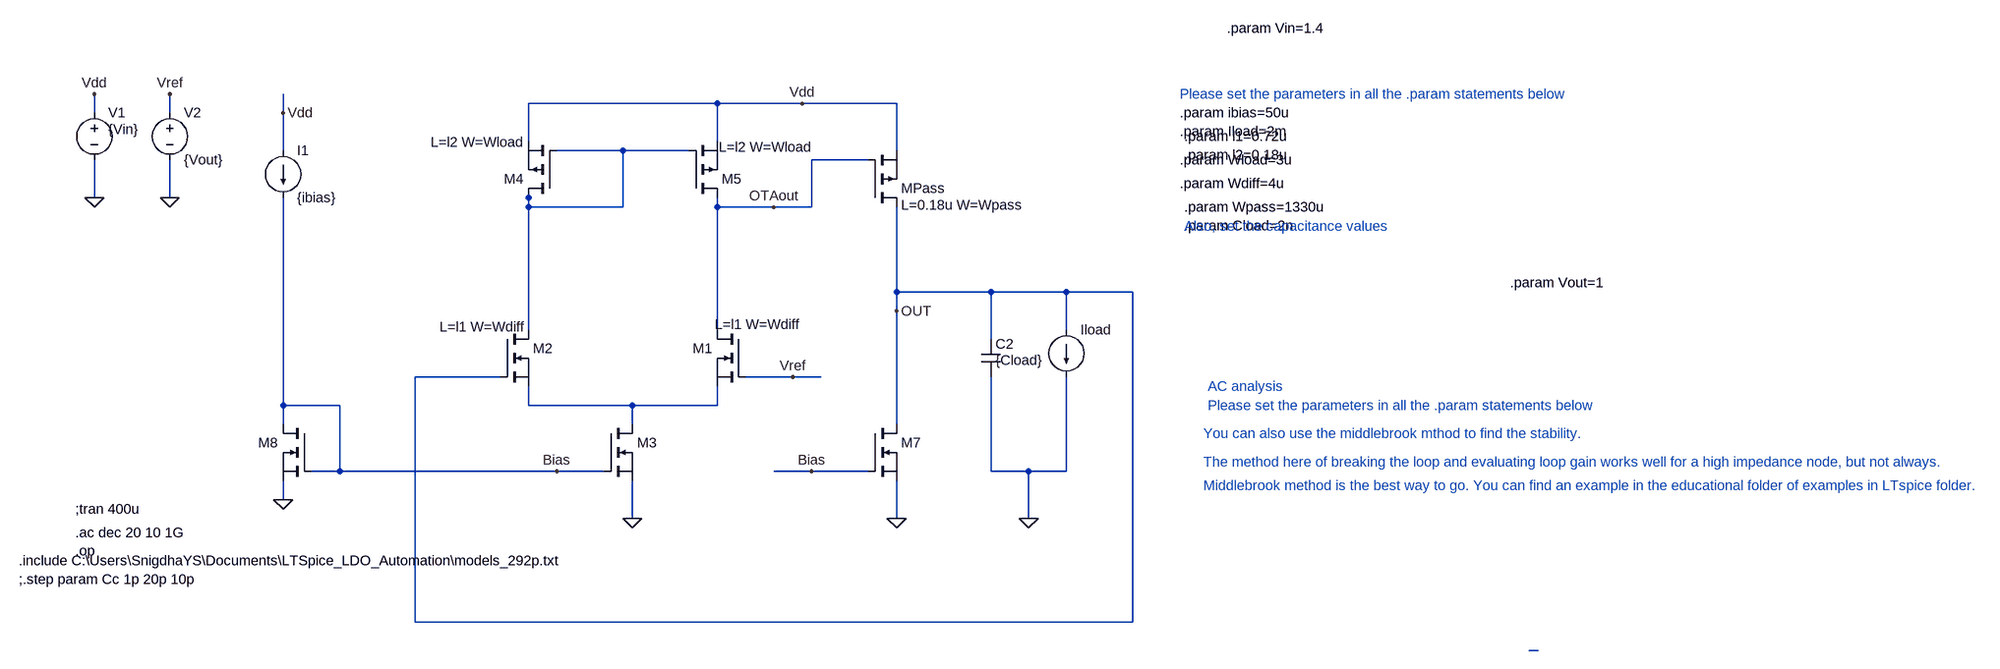
[diagram p0: schematic LDO_PSRR_IIIT_updated.asc]
LDO_PSRR_IIIT_updated.asc, the LTspice schematic file:
Version 4
.param ibias=10.0 Iload=10.0 Wdiff=0.7723647085355052 Wpass=1.1331343651728623 Cload=1.0 Wload=2.28647097820951 Vin=1.4 Vout=1.0 l1=0.72 l2=0.54
SHEET 1 5048 1020
WIRE 288 -288 -32 -288
WIRE 432 -288 288 -288
WIRE 592 -288 432 -288
WIRE -768 -272 -768 -304
WIRE -640 -272 -640 -304
WIRE -448 -272 -448 -304
WIRE -32 -224 -32 -288
WIRE 288 -224 288 -288
WIRE -448 -208 -448 -272
WIRE 128 -208 16 -208
WIRE 240 -208 128 -208
WIRE 592 -208 592 -288
WIRE 544 -192 448 -192
WIRE -768 -128 -768 -192
WIRE -640 -128 -640 -192
WIRE -32 -128 -32 -144
WIRE -32 -112 -32 -128
WIRE 128 -112 128 -208
WIRE 128 -112 -32 -112
WIRE 288 -112 288 -128
WIRE 384 -112 288 -112
WIRE 448 -112 448 -192
WIRE 448 -112 384 -112
WIRE 592 32 592 -112
WIRE 752 32 592 32
WIRE 880 32 752 32
WIRE 992 32 880 32
WIRE 592 64 592 32
WIRE -32 96 -32 -112
WIRE 288 96 288 -112
WIRE 880 96 880 32
WIRE 752 112 752 32
WIRE -80 176 -224 176
WIRE 416 176 336 176
WIRE 464 176 416 176
WIRE -448 224 -448 -128
WIRE -352 224 -448 224
WIRE -32 224 -32 192
WIRE 144 224 -32 224
WIRE 288 224 288 192
WIRE 288 224 144 224
WIRE -448 256 -448 224
WIRE 144 256 144 224
WIRE 592 256 592 64
WIRE -352 336 -352 224
WIRE -352 336 -400 336
WIRE 16 336 -352 336
WIRE 96 336 16 336
WIRE 448 336 384 336
WIRE 544 336 448 336
WIRE 752 336 752 176
WIRE 816 336 752 336
WIRE 880 336 880 176
WIRE 880 336 816 336
WIRE -448 384 -448 352
WIRE 144 416 144 352
WIRE 592 416 592 352
WIRE 816 416 816 336
WIRE -224 592 -224 176
WIRE 992 592 992 32
WIRE 992 592 -224 592
WIRE 1680 640 1664 640
FLAG 144 416 0
FLAG 592 416 0
FLAG 448 336 Bias
FLAG 16 336 Bias
FLAG 592 64 OUT
FLAG -768 -128 0
FLAG -768 -304 Vdd
FLAG 432 -288 Vdd
FLAG -640 -128 0
FLAG -640 -304 Vref
FLAG 416 176 Vref
FLAG -448 384 0
FLAG -448 -272 Vdd
FLAG 816 416 0
FLAG 384 -112 OTAout
DATAFLAG 672 32 "$"
DATAFLAG -80 336 "$"
DATAFLAG 16 224 "$"
DATAFLAG 80 -112 "$"
DATAFLAG 160 -288 "$"
DATAFLAG 288 -16 "$"
SYMBOL nmos 336 96 M0
WINDOW 3 56 72 Invisible 2
WINDOW 39 -93 -9 Left 2
SYMATTR Value nmos292p
SYMATTR SpiceLine L=l1 W=Wdiff
SYMATTR InstName M1
SYMBOL nmos -80 96 R0
WINDOW 3 56 72 Invisible 2
WINDOW 39 -103 -5 Left 2
SYMATTR Value nmos292p
SYMATTR SpiceLine L=l1 W=Wdiff
SYMATTR InstName M2
SYMBOL nmos 96 256 R0
WINDOW 3 56 72 Invisible 2
SYMATTR Value nmos292p
SYMATTR InstName M3
SYMATTR SpiceLine L=1u W=10u
SYMBOL pmos 16 -128 R180
WINDOW 3 56 72 Invisible 2
WINDOW 39 55 94 Left 2
SYMATTR Value pmos292p
SYMATTR SpiceLine L=l2 W=Wload
SYMATTR InstName M4
SYMBOL pmos 240 -128 M180
WINDOW 3 56 72 Invisible 2
WINDOW 39 51 86 Left 2
SYMATTR Value pmos292p
SYMATTR SpiceLine L=l2 W=Wload
SYMATTR InstName M5
SYMBOL pmos 544 -112 M180
WINDOW 3 56 72 Invisible 2
WINDOW 39 56 4 Left 2
SYMATTR Value pmos292p
SYMATTR SpiceLine L=0.18u W=Wpass
SYMATTR InstName MPass
SYMBOL nmos 544 256 R0
WINDOW 3 56 72 Invisible 2
SYMATTR Value nmos292p
SYMATTR InstName M7
SYMATTR SpiceLine L=1u W=10u
SYMBOL voltage -768 -288 R0
WINDOW 3 24 44 Left 2
WINDOW 39 0 0 Left 2
SYMATTR Value {Vin}
SYMATTR Value2 AC 1
SYMATTR InstName V1
SYMBOL voltage -640 -288 R0
WINDOW 123 0 0 Left 0
WINDOW 39 0 0 Left 0
SYMATTR InstName V2
SYMATTR Value {Vout}
SYMBOL nmos -400 256 M0
WINDOW 3 56 72 Invisible 2
SYMATTR Value nmos292p
SYMATTR SpiceLine L=1u W=10u
SYMATTR InstName M8
SYMBOL current -448 -208 R0
SYMATTR InstName I1
SYMATTR Value {ibias}
SYMBOL current 880 96 R0
WINDOW 3 24 80 Invisible 2
WINDOW 123 0 0 Left 2
WINDOW 39 0 0 Left 2
SYMATTR Value {Iload}
SYMATTR InstName Iload
SYMBOL cap 736 112 R0
WINDOW 3 24 36 Left 2
SYMATTR Value {Cload}
SYMATTR InstName C2
TEXT -896 488 Left 2 !.include C:\\Users\\SnigdhaYS\\Documents\\LTSpice_LDO_Automation\\models_292p.txt\n;.step param Cc 1p 20p 10p
TEXT -800 440 Left 2 !.ac dec 20 10 1G\n.op
TEXT 1072 -272 Left 2 !.param ibias=50u\n.param Iload=2m
TEXT 1080 -232 Left 2 !.param l1=0.72u\n.param l2=0.18u
TEXT -800 400 Left 2 !;tran 400u
TEXT 1072 -304 Left 2 ;Please set the parameters in all the .param statements below
TEXT 1072 -192 Left 2 !.param Wload=3u
TEXT 1072 -152 Left 2 !.param Wdiff=4u
TEXT 1080 -112 Left 2 !.param Wpass=1330u\n.param Cload=2n
TEXT 1080 -80 Left 2 ;Also, set the capacitance values
TEXT 1112 272 Left 2 ;You can also use the middlebrook mthod to find the stability.
TEXT 1120 224 Left 2 ;Please set the parameters in all the .param statements below
TEXT 1112 320 Left 2 ;The method here of breaking the loop and evaluating loop gain works well for a high impedance node, but not always.
TEXT 1112 360 Left 2 ;Middlebrook method is the best way to go. You can find an example in the educational folder of examples in LTspice folder.
TEXT 1120 192 Left 2 ;AC analysis
TEXT 1152 -416 Left 2 !.param Vin=1.4
TEXT 1632 16 Left 2 !.param Vout=1

The netlist it stands for:
* LDO_PSRR_IIIT_updated.asc
M1 OTAout Vref N002 N002 nmos292p L=l1 W=Wdiff
M2 N001 OUT N002 N002 nmos292p L=l1 W=Wdiff
M3 N002 Bias 0 0 nmos292p L=1u W=10u
M4 N001 N001 Vdd Vdd pmos292p L=l2 W=Wload
M5 OTAout N001 Vdd Vdd pmos292p L=l2 W=Wload
MPass OUT OTAout Vdd Vdd pmos292p L=0.18u W=Wpass
M7 OUT Bias 0 0 nmos292p L=1u W=10u
V1 Vdd 0 {Vin} AC 1
V2 Vref 0 {Vout}
M8 Bias Bias 0 0 nmos292p L=1u W=10u
I1 Vdd Bias {ibias}
Iload OUT 0 {Iload}
C2 OUT 0 {Cload}
.model NMOS NMOS
.model PMOS PMOS
.lib standard.mos
.include C:\Users\SnigdhaYS\Documents\LTSpice_LDO_Automation\models_292p.txt
;.step param Cc 1p 20p 10p
.ac dec 20 10 1G
.op
.param ibias=50u
.param Iload=2m
.param l1=0.72u
.param l2=0.18u
;tran 400u
* Please set the parameters in all the .param statements below
.param Wload=3u
.param Wdiff=4u
.param Wpass=1330u
.param Cload=2n
* Also, set the capacitance values
* You can also use the middlebrook mthod to find the stability.
* Please set the parameters in all the .param statements below
* The method here of breaking the loop and evaluating loop gain works well for a high impedance node, but not always.
* Middlebrook method is the best way to go. You can find an example in the educational folder of examples in LTspice folder.
* AC analysis
.param Vin=1.4
.param Vout=1
.backanno
.end